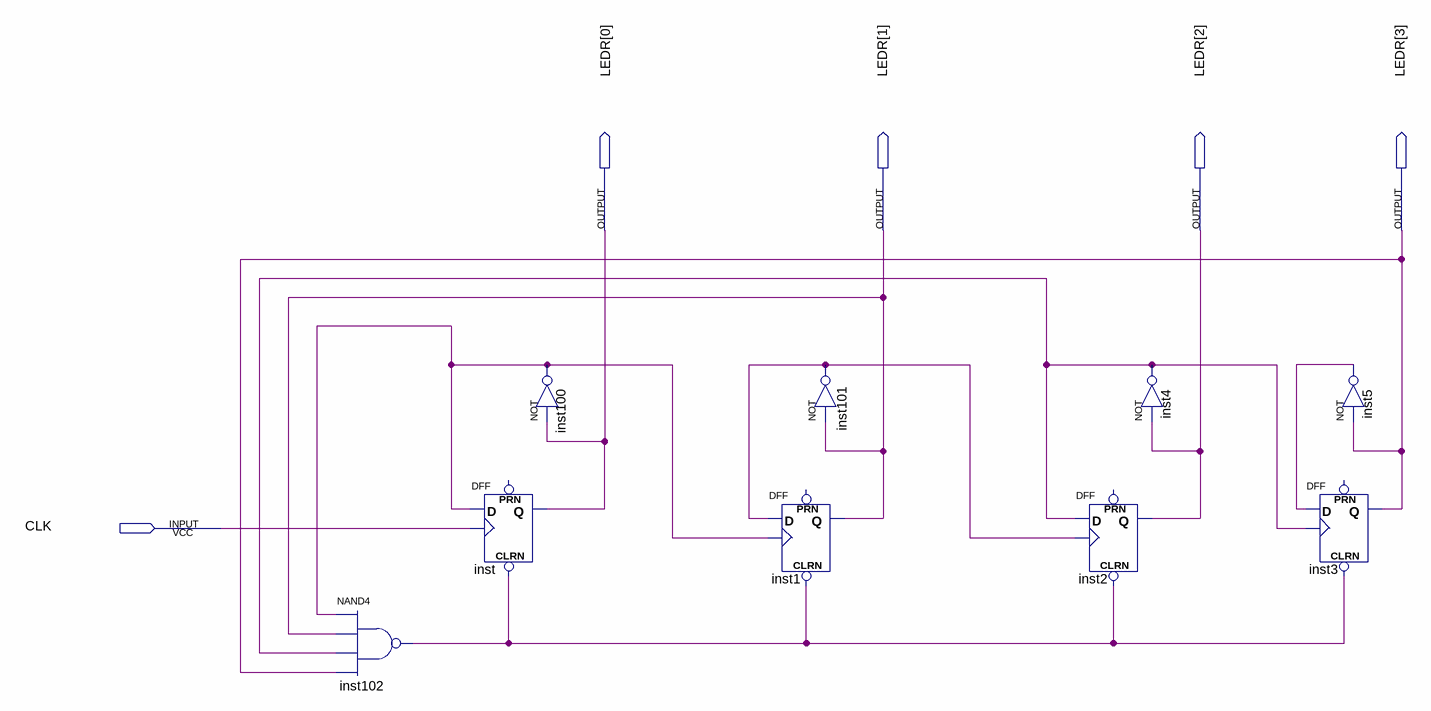
[diagram p0: schematic sheet]
// Quartus schematic lab23.bdf as structural Verilog: 9 symbols, 5 pins
module lab23 (
  input  CLK,
  output [3:0] LEDR
);

  wire inst4_out, inst5_out, inst100_out, inst101_out, inst102_out;

  nand inst102 (inst102_out, inst100_out, LEDR[1], inst4_out, LEDR[3]);
  DFF inst (.CLRN(inst102_out), .CLK(CLK), .D(inst100_out), .Q(LEDR[0]));  // open: PRN
  not inst100 (inst100_out, LEDR[0]);
  DFF inst1 (.CLRN(inst102_out), .CLK(inst100_out), .D(inst101_out), .Q(LEDR[1]));  // open: PRN
  not inst101 (inst101_out, LEDR[1]);
  DFF inst2 (.CLRN(inst102_out), .CLK(inst101_out), .D(inst4_out), .Q(LEDR[2]));  // open: PRN
  not inst4 (inst4_out, LEDR[2]);
  DFF inst3 (.CLRN(inst102_out), .CLK(inst4_out), .D(inst5_out), .Q(LEDR[3]));  // open: PRN
  not inst5 (inst5_out, LEDR[3]);
endmodule
